# EAGLE design a314-q&d-vcf (EAGLE 7.5.1)
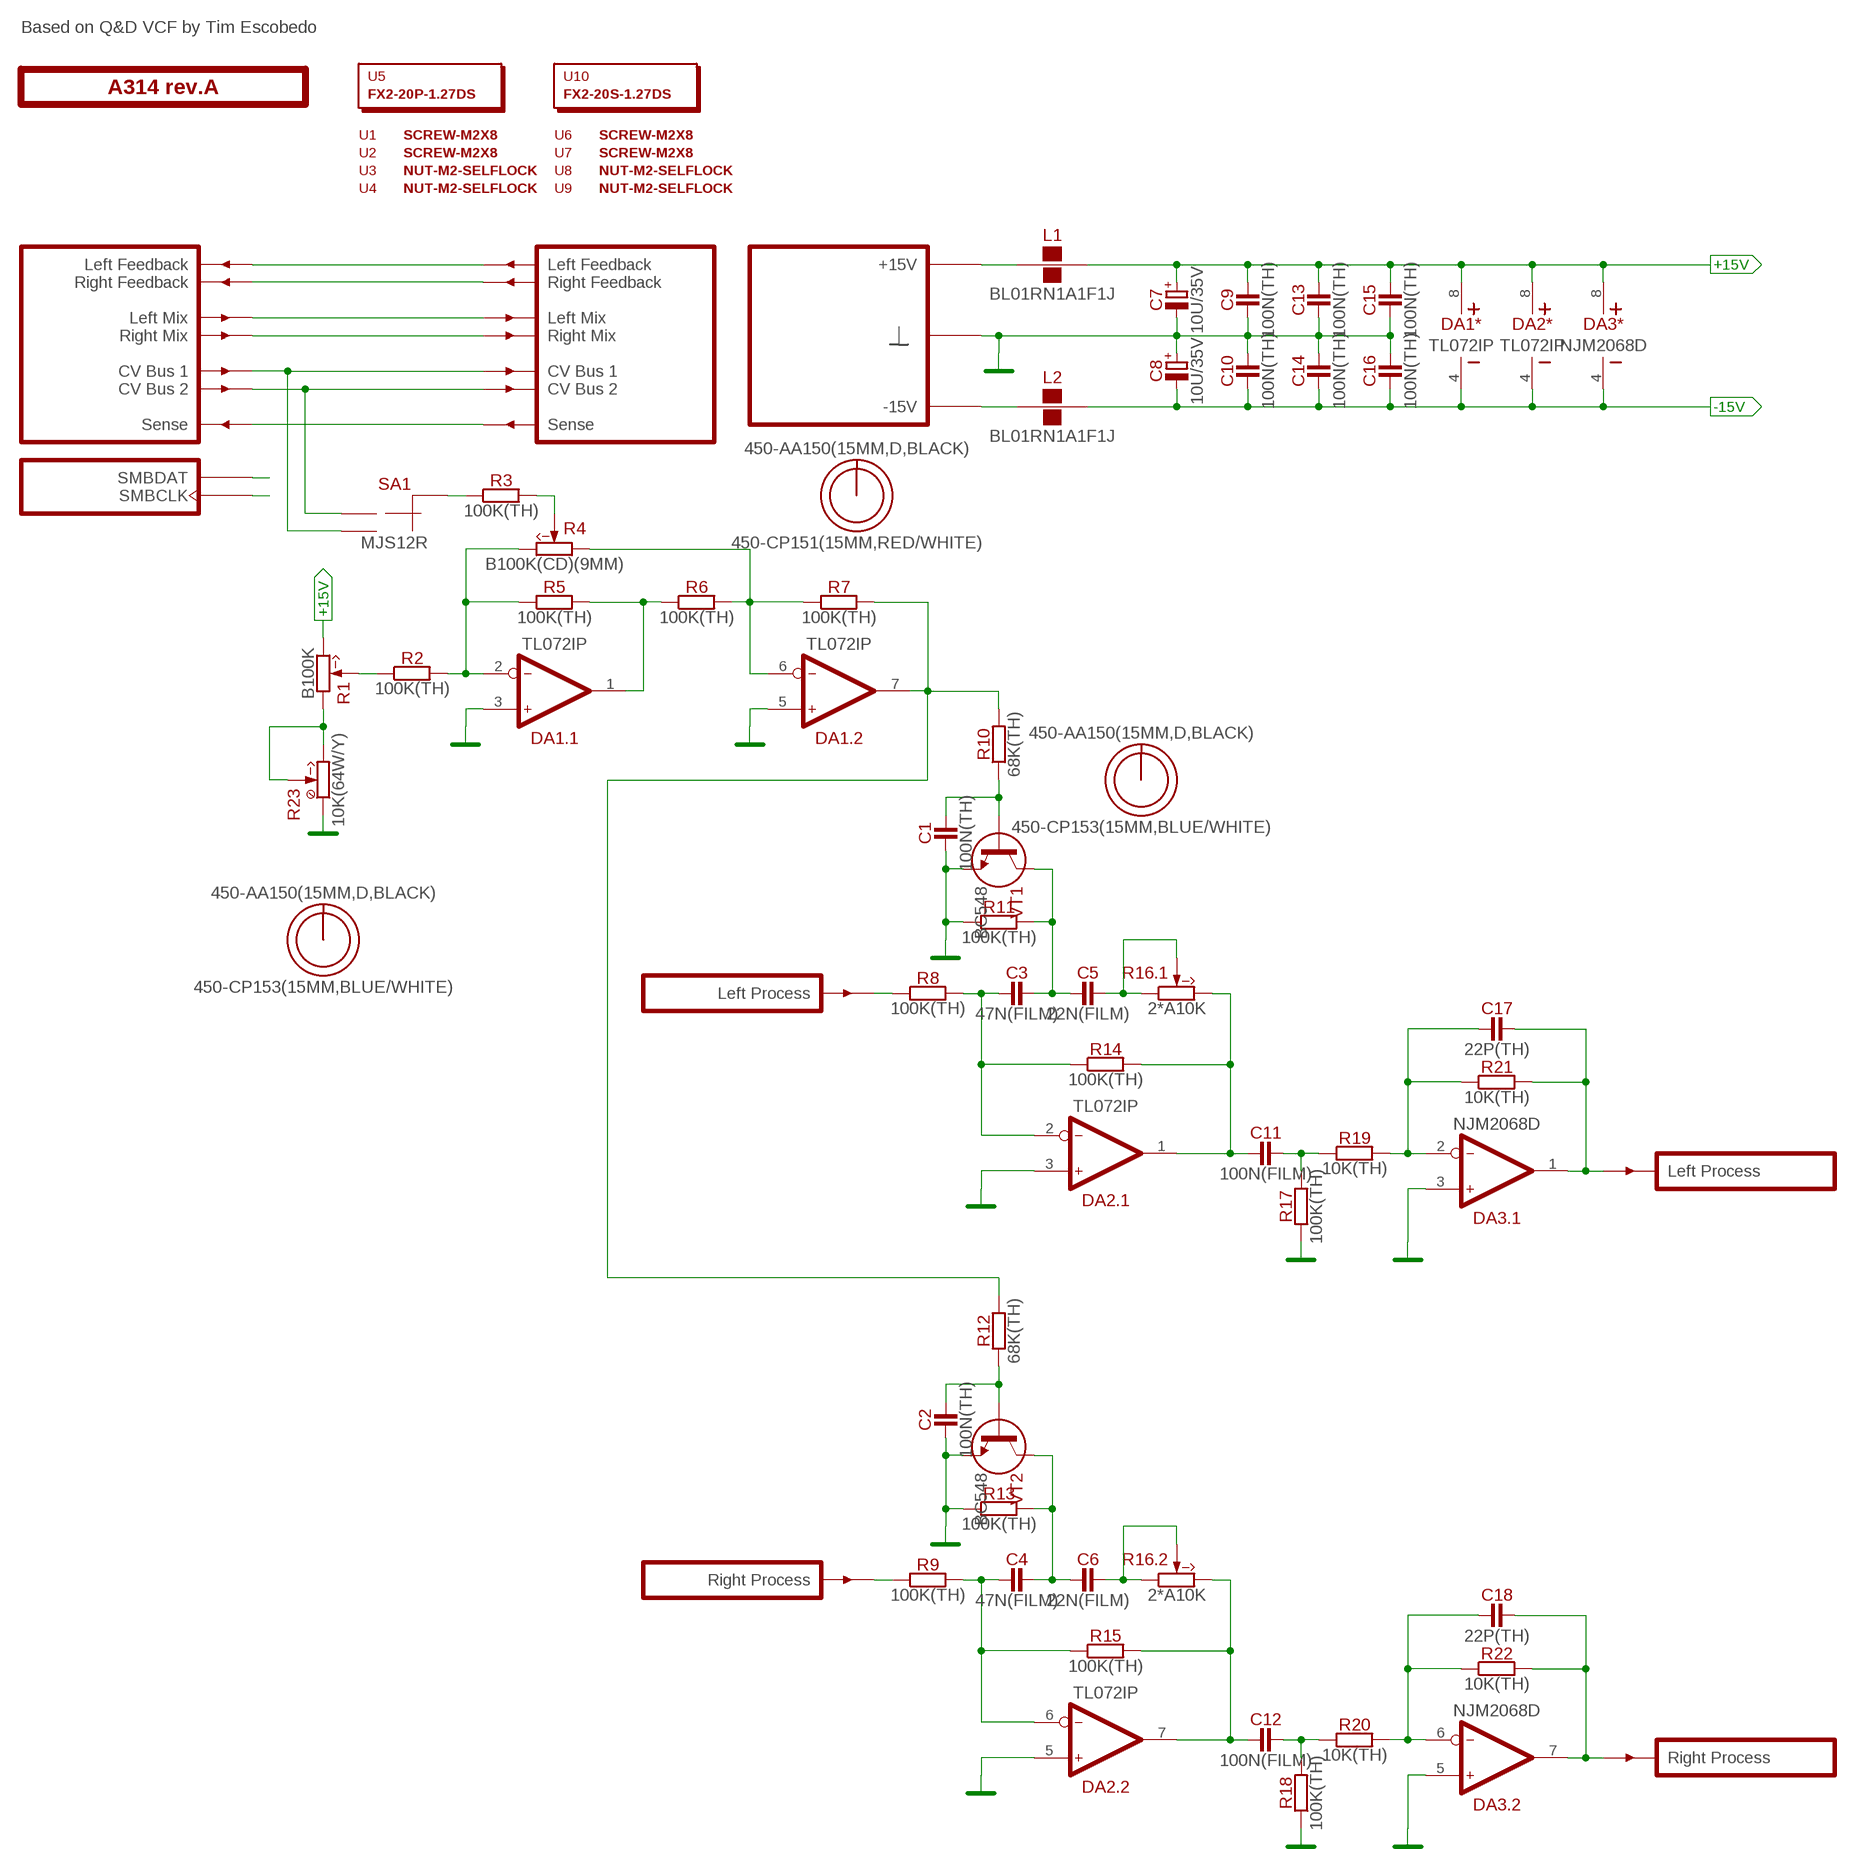
[diagram p0: schematic, sheet 1]

## Parts
C1  100N(TH)  [C050-024X044]
C2  100N(TH)  [C050-024X044]
C3  47N(FILM)  [C050-025X075]
C4  47N(FILM)  [C050-025X075]
C5  22N(FILM)  [C050-025X075]
C6  22N(FILM)  [C050-025X075]
C7  10U/35V  [E2-5]
C8  10U/35V  [E2-5]
C9  100N(TH)  [C050-024X044]
C10  100N(TH)  [C050-024X044]
C11  100N(FILM)  [C050-025X075]
C12  100N(FILM)  [C050-025X075]
C13  100N(TH)  [C050-024X044]
C14  100N(TH)  [C050-024X044]
C15  100N(TH)  [C050-024X044]
C16  100N(TH)  [C050-024X044]
C17  22P(TH)  [C050-024X044]
C18  22P(TH)  [C050-024X044]
DA1  TL072IP  [DIP-8]
DA2  TL072IP  [DIP-8]
DA3  NJM2068D  [DIP-8]
L1  BL01RN1A1F1J  [BL01RN1A]
L2  BL01RN1A1F1J  [BL01RN1A]
O1  450-AA150(15MM,D,BLACK)  [EMPTY]
O2  450-AA150(15MM,D,BLACK)  [EMPTY]
O3  450-AA150(15MM,D,BLACK)  [EMPTY]
O4  450-CP151(15MM,RED/WHITE)  [EMPTY]
O5  450-CP153(15MM,BLUE/WHITE)  [EMPTY]
O6  450-CP153(15MM,BLUE/WHITE)  [EMPTY]
PCB1  A314 rev.A  ST2-BOARD-50  [ST2-BOARD-50]
R1  B100K  [RV11-SINGLE]
R2  100K(TH)  [R-0207/10]
R3  100K(TH)  [R-0207/10]
R4  B100K(CD)(9MM)  [RV09-SINGLE]
R5  100K(TH)  [R-0207/10]
R6  100K(TH)  [R-0207/10]
R7  100K(TH)  [R-0207/10]
R8  100K(TH)  [R-0207/10]
R9  100K(TH)  [R-0207/10]
R10  68K(TH)  [R-0207/10]
R11  100K(TH)  [R-0207/10]
R12  68K(TH)  [R-0207/10]
R13  100K(TH)  [R-0207/10]
R14  100K(TH)  [R-0207/10]
R15  100K(TH)  [R-0207/10]
R16  2*A10K  2A10K  [RV11-DUAL]
R17  100K(TH)  [R-0207/10]
R18  100K(TH)  [R-0207/10]
R19  10K(TH)  [R-0207/10]
R20  10K(TH)  [R-0207/10]
R21  10K(TH)  [R-0207/10]
R22  10K(TH)  [R-0207/10]
R23  10K(64W/Y)  [64W]
SA1  MJS12R  [APEM-MJS12R]
U1  SCREW-M2X8  [EMPTY]
U2  SCREW-M2X8  [EMPTY]
U3  NUT-M2-SELFLOCK  [EMPTY]
U4  NUT-M2-SELFLOCK  [EMPTY]
U5  FX2-20P-1.27DS  [EMPTY]
U6  SCREW-M2X8  [EMPTY]
U7  SCREW-M2X8  [EMPTY]
U8  NUT-M2-SELFLOCK  [EMPTY]
U9  NUT-M2-SELFLOCK  [EMPTY]
U10  FX2-20S-1.27DS  [EMPTY]
VT1  BC548  [TO92]
VT2  BC548  [TO92]

## Nets
+15V: C7.+ C9.2 C13.2 C15.2 DA1.8(*:V+) DA2.8(*:V+) DA3.8(*:V+) L1.2 R1.3(CW)
-15V: C8.- C10.1 C14.1 C16.1 DA1.4(*:V-) DA2.4(*:V-) DA3.4(*:V-) L2.2
GND: C1.1 C2.1 C7.- C8.+ C9.1 C10.2 C13.1 C14.2 C15.1 C16.2 DA1.3(.1:IN+) DA1.5(.2:IN+) DA2.3(.1:IN+) DA2.5(.2:IN+) DA3.3(.1:IN+) DA3.5(.2:IN+) PCB1.B4'(GND) PCB1.B4(GND) PCB1.B5'(GND) PCB1.B5(GND) PCB1.B6'(GND) PCB1.B6(GND) PCB1.B7'(GND) PCB1.B7(GND) PCB1.B8'(GND) PCB1.B8(GND) R11.1 R13.1 R17.1 R18.1 R23.1(CCW) VT1.3(E) VT2.3(E)
LMIX: PCB1.ALMIX'(LMIX') PCB1.ALMIX(LMIX)
N$1: L1.1 PCB1.A+15'(P+15V) PCB1.A+15(P+15V) PCB1.B+15'(P+15V) PCB1.B+15(P+15V)
N$2: PCB1.ALFBK'(LFBK') PCB1.ALFBK(LFBK)
N$3: R3.2 R4.2(W)
N$4: PCB1.ARFBK'(RFBK') PCB1.ARFBK(RFBK)
N$5: DA1.2(.1:IN-) R2.2 R4.3(CW) R5.1
N$6: DA1.1(.1:OUT) R5.2 R6.1
N$7: DA1.6(.2:IN-) R4.1(CCW) R6.2 R7.1
N$8: C18.1 DA3.6(.2:IN-) R20.2 R22.1
N$9: R3.1 SA1.C(CM)
N$10: C4.1 DA2.6(.2:IN-) R9.2 R15.1
N$11: C3.1 DA2.2(.1:IN-) R8.2 R14.1
N$12: PCB1.BINL(INL) R8.1
N$13: R1.2(W) R2.1
N$14: C11.1 DA2.1(.1:OUT) R14.2 R16.3(.1:CW)
N$15: PCB1.ACV1'(CV1') PCB1.ACV1(CV1) SA1.NO
N$16: PCB1.BSENSE'(SENSE') PCB1.BSENSE(SENSE)
N$17: C11.2 R17.2 R19.1
N$18: C12.1 DA2.7(.2:OUT) R15.2 R16.3'(.2:CW)
N$19: C5.2 R16.1(.1:CCW) R16.2(.1:W)
N$20: C12.2 R18.2 R20.1
N$21: C6.2 R16.1'(.2:CCW) R16.2'(.2:W)
N$22: C3.2 C5.1 R11.2 VT1.1(C)
N$23: C1.2 R10.1 VT1.2(B)
N$24: C4.2 C6.1 R13.2 VT2.1(C)
N$25: L2.1 PCB1.A-15'(P-15V) PCB1.A-15(P-15V) PCB1.B-15'(P-15V) PCB1.B-15(P-15V)
N$26: C2.2 R12.1 VT2.2(B)
N$27: PCB1.BINR(INR) R9.1
N$28: DA1.7(.2:OUT) R7.2 R10.2 R12.2
N$29: C18.2 DA3.7(.2:OUT) PCB1.BOUTR'(OUTR) R22.2
N$30: C17.1 DA3.2(.1:IN-) R19.2 R21.1
N$31: C17.2 DA3.1(.1:OUT) PCB1.BOUTL'(OUTL) R21.2
N$33: R1.1(CCW) R23.3(CW) R23.S(W) R23.S@1(W)
N$38: PCB1.ASMBDAT'(SMBDAT) PCB1.ASMBDAT(SMBDAT)
N$42: PCB1.ACV2'(CV2') PCB1.ACV2(CV2) SA1.NC
N$43: PCB1.ASMBCLK'(SMBCLK) PCB1.ASMBCLK(SMBCLK)
RMIX: PCB1.ARMIX'(RMIX') PCB1.ARMIX(RMIX)

## Notes on the sheet
- Based on Q&D VCF by Tim Escobedo

## Library data of the parts
C1 C2 C9 C10 C13-C16 = capacitors:?; MOUSER: 81-RCER71H104K0A2H3B
C3 C4 = capacitors:?; MOUSER: 871-B32529C1473J
C5 C6 = capacitors:?; MOUSER: 80-R82EC2220DQ50J
C7 C8 = capacitors-electrolytic:?; MOUSER: 647-USW1V100MDD
C11 C12 = capacitors:?; MOUSER: 505-MKS2.1/63/5
C17 C18 = capacitors:?
DA1 DA2 = ic-ti:TL072; MOUSER: 595-TL072IP
DA3 = ic-jrc:NJM2068; MOUSER: 513-NJM2068D
L1 L2 = inductors:BL01RN1A?; MOUSER: 81-BL01RN1A1F1J
O1-O3 = hardware:450-AA?; MOUSER: 450-AA150
O4 = hardware:450-C?
O5 O6 = hardware:450-C?; MOUSER: 450-CP153
PCB1 = module-footprints:ST2-BOARD-?
R1 = potentiometers:?
R2 R3 R5-R9 R11 R13-R15 R17 R18 = resistors:?; MOUSER: 71-RN55D-F-100K
R4 = potentiometers:?; MOUSER: 652-PTV09A-4225FB104
R10 R12 = resistors:?
R16 = potentiometers:2**?; MOUSER: 688-RK12L12C0A0E
R19-R22 = resistors:?; MOUSER: 71-RN55D-F-10K
R23 = potentiometers:?(64W/Y); MOUSER: 858-64WR10KLF
SA1 = switches:MJS12R; MOUSER: 642-MJS12R
U1-U4 U6-U9 = hardware:*?
U5 = hardware:?; MOUSER: 798-FX2-20P-1.27DS71
U10 = hardware:?; MOUSER: 798-FX2-20S-1.27DS71
VT1 VT2 = transistors-npn:?

## Board
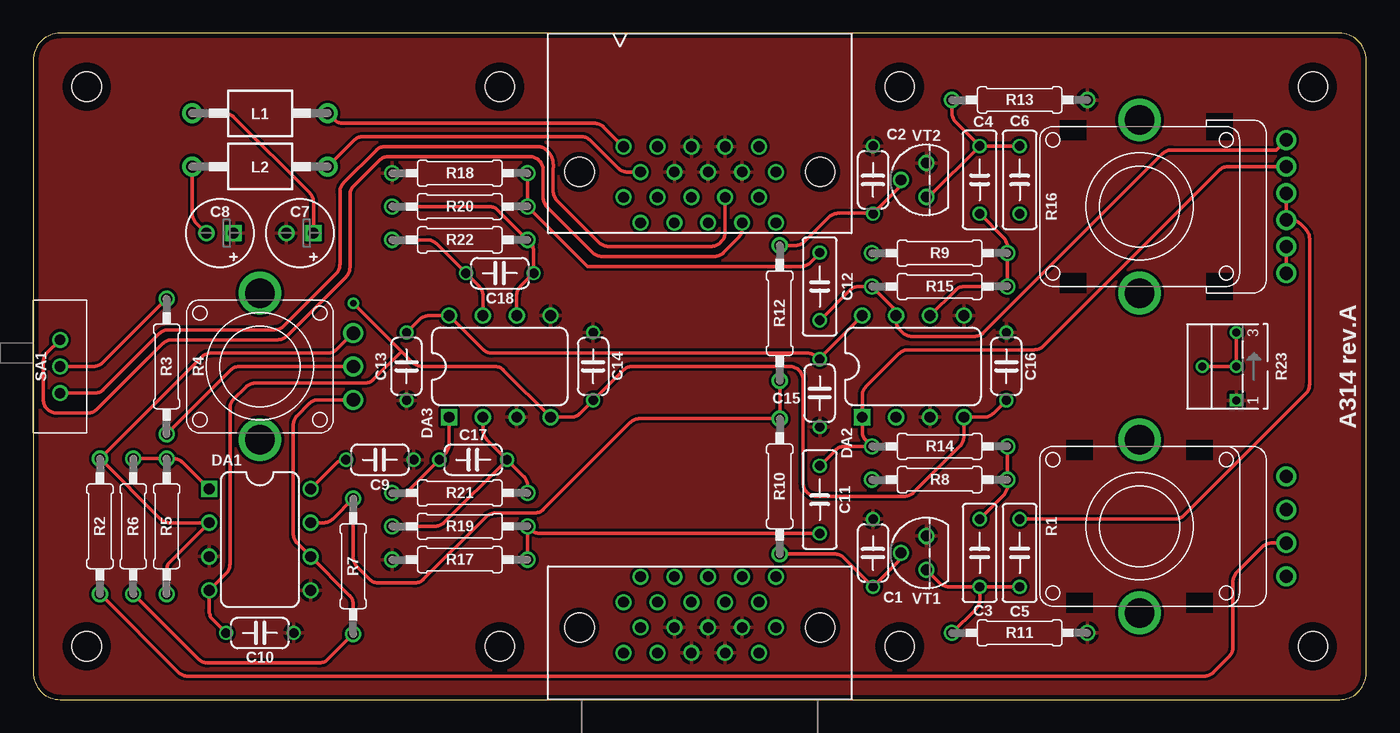
[diagram p1: board, top side]
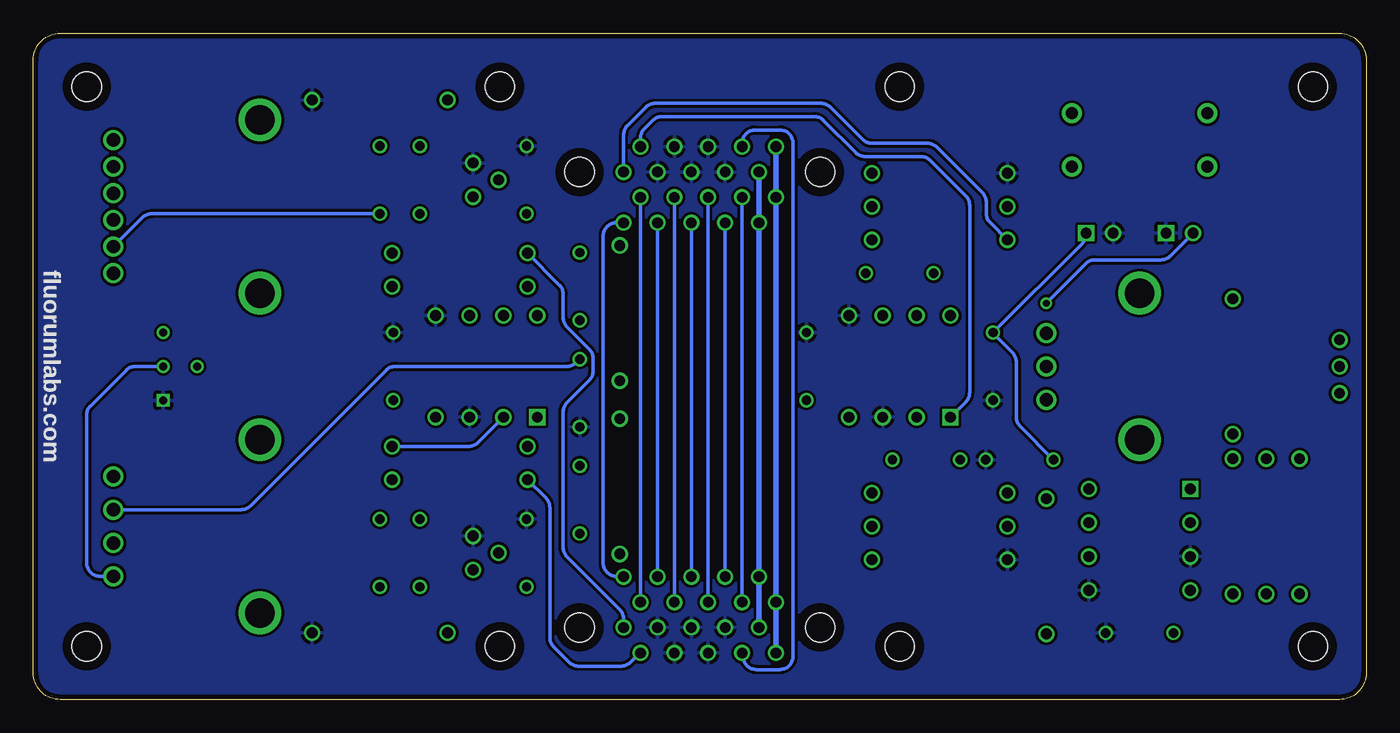
[diagram p2: board, bottom side, seen from below]

Size 100 x 50 mm. Coordinates in mm from the lower left corner, seen from the top.
Outline: 0,48 0,2 arc90 2,0 98,0 arc90 100,2 100,48 arc90 98,50 2,50 arc90 0,48
Copper layers (1*16): Top 0.0356mm / dielectric 1.5011mm / Bottom 0.0356mm
Design rules "sonictrain": minimum track width 6mil, minimum drill 13mil, track to track 8mil, track to pad 8mil, pad to pad 6mil, via to via 6mil, smd to smd 6mil, copper to edge 15mil, drill to drill 6mil, minimum pad ring 7mil, minimum via ring 7mil, stop-mask expansion 3mil, vias tented up to drill 25mil, thermal gap 10mil

### Footprints (pad centres in the part's own frame; a part is rotated, then mirrored left to right if it is on the bottom)
C050-024X044 = drill 0.7: 1 -2.54,0; 2 2.54,0
C050-025X075 = drill 0.7: 1 -2.54,0; 2 2.54,0
E2-5 = drill 0.813 square: + -1.016,0 | drill 0.813: - 1.016,0
DIP-8 = drill 0.813 square: 1 -3.81,-3.81 | drill 0.813: 2 -1.27,-3.81; 3 1.27,-3.81; 4 3.81,-3.81; 5 3.81,3.81; 6 1.27,3.81; 7 -1.27,3.81; 8 -3.81,3.81
BL01RN1A = drill 0.9 pad 1.5: 1 -5.08,0; 2 5.08,0
ST2-BOARD-50 = drill 0.8: A+15 44.285,7.31; A+15' 44.285,37.69; A-15 45.555,9.215; A-15' 45.555,35.785; ACV1 51.905,7.31; ACV1' 51.905,37.69; ACV2 53.175,9.215; ACV2' 53.175,35.785; ALFBK 49.365,7.31; ALFBK' 49.365,37.69; ALMIX 46.825,7.31; ALMIX' 46.825,37.69; ARFBK 50.635,9.215; ARFBK' 50.635,35.785; ARMIX 48.095,9.215; ARMIX' 48.095,35.785; ASMBCLK 55.715,9.215; ASMBCLK' 55.715,35.785; ASMBDAT 54.445,7.31; ASMBDAT' 54.445,37.69; B4 48.095,5.405; B4' 48.095,39.595; B5 49.365,3.5; B5' 49.365,41.5; B6 50.635,5.405; B6' 50.635,39.595; B7 51.905,3.5; B7' 51.905,41.5; B8 53.175,5.405; B8' 53.175,39.595; B+15 44.285,3.5; B+15' 44.285,41.5; B-15 45.555,5.405; B-15' 45.555,39.595; BINL 54.445,3.5; BINR 55.715,5.405; BOUTL' 54.445,41.5; BOUTR' 55.715,39.595; BSENSE 46.825,3.5; BSENSE' 46.825,41.5 | hole 2.2: 4,4; 4,46; 96,4; 96,46; 35,46; 65,46; 65,4; 35,4; 59.025,5.405; 40.975,5.405; 40.975,39.595; 59.025,39.595
RV11-SINGLE = drill 1: 1 -3.75,-11; 2 -1.25,-11; 3 1.25,-11; 4 3.75,-11 | drill 2.2: S1 -6.5,0; S2 6.5,0
R-0207/10 = drill 0.813: 1 -5.08,0; 2 5.08,0
RV09-SINGLE = drill 1: 1 -2.5,-7; 2 0,-7; 3 2.5,-7 | drill 2.2: S1 -5.5,0; S2 5.5,0
RV11-DUAL = drill 1: 1 -1,-11; 1' -3,-11; 2 1,-11; 2' -5,-11; 3 3,-11; 3' 5,-11 | drill 2.2: S1 -6.5,0; S2 6.5,0
64W = drill 0.6 square: 1 2.54,0 | drill 0.6: 3 -2.54,0; S 0,-2.54; S@1 0,0
APEM-MJS12R = drill 0.8: C 0,-2; NC 2,-2; NO -2,-2
TO92 = drill 0.813: 1 -1.27,0; 2 0,1.905; 3 1.27,0

### Placement (x,y rotation side)
C1  63,11 270 top
C2  63,39 270 top
C3  71,11 270 top
C4  71,39 90 top
C5  74,11 90 top
C6  74,39 270 top
C7  20,35 180 top
C8  14,35 180 top
C9  26,18 180 top
C10  17,5 0 top
C11  59,15 270 top
C12  59,31 90 top
C13  28,25 90 top
C14  42,25 90 top
C15  59,23 90 top
C16  73,25 90 top
C17  33,18 180 top
C18  35,32 180 top
DA1  17,12 270 top
DA2  66,25 0 top
DA3  35,25 0 top
L1  17,44 180 top
L2  17,40 180 top
O1  -8,-101.25 0 top  (outside the outline)
O2  -9,-102.5 0 top  (outside the outline)
O3  -10,-103.75 0 top  (outside the outline)
O4  -11,-105 0 top  (outside the outline)
O5  -12,-106.25 0 top  (outside the outline)
O6  -13,-107.5 0 top  (outside the outline)
PCB1  0,0 0 top
R1  83,13 90 top
R2  5,13 90 top
R3  10,25 270 top
R4  17,25 90 top
R5  10,13 90 top
R6  7.5,13 270 top
R7  24,10 90 top
R8  68,16.5 0 top
R9  68,33.5 0 top
R10  56,16 90 top
R11  74,5 180 top
R12  56,29 270 top
R13  74,45 180 top
R14  68,19 180 top
R15  68,31 180 top
R16  83,37 90 top
R17  32,10.5 0 top
R18  32,39.5 0 top
R19  32,13 180 top
R20  32,37 180 top
R21  32,15.5 180 top
R22  32,34.5 180 top
R23  90.25,25 270 top
SA1  0,25 90 top
U1  54,-100 0 top  (outside the outline)
U2  57,-100 0 top  (outside the outline)
U3  60,-100 0 top  (outside the outline)
U4  63,-100 0 top  (outside the outline)
U5  66,-100 0 top  (outside the outline)
U6  69,-100 0 top  (outside the outline)
U7  72,-100 0 top  (outside the outline)
U8  75,-100 0 top  (outside the outline)
U9  78,-100 0 top  (outside the outline)
U10  81,-100 0 top  (outside the outline)
VT1  67,11 90 top
VT2  67,39 90 top

### Tracks (layer width: path | path; a pad name or v marks a point on that pad's centre or on a via)
+15V
  Top 0.254: C9.2 23.41,18 arc45 22.71,17.71 DA1.8 | C13.2 28.98,28.52 arc-45 29.68,28.81 DA3.8 33.71,26.29 arc45 34.41,26 58.09,26 arc-45 58.79,25.71 58.96,25.54 C15.2 59,25.62 DA2.8 | C7.+ 21.02,37.32 arc45 20.72,38.03 15.04,43.71 arc45 14.34,44 L1.2
  Bottom 0.254: R1.3 84.41,14.25 arc-45 83.71,14.54 73.54,24.71 arc45 72.84,25 59.95,25 arc-45 59.25,25.29 C15.2 | C7.+ 21.02,34.94 arc45 21.31,34.23 C13.2 28,27.5 26.54,26.04 arc45 26.25,25.34 26.25,21.2 arc-45 25.96,20.5 C9.2
-15V  (via drill 0.5)
  Top 0.254: C10.1 13.48,5.98 arc-45 13.19,6.68 DA1.4 14.46,9.46 arc45 14.75,10.16 14.75,21.84 arc-45 15.04,22.54 15.96,23.46 arc-45 16.66,23.75 24.84,23.75 arc45 25.54,24.04 27.62,26.12 | C16.1 72.02,21.48 arc-45 71.32,21.19 DA2.4 69.81,19.72 arc-45 69.52,19.02 66.04,15.54 arc-45 65.34,15.25 58.75,15.25 arc-90 57.75,16.25 57.75,24 arc90 56.75,25 44.95,25 arc45 44.25,24.71 C14.1 41.02,21.48 arc-45 40.32,21.19 DA3.4 35.29,24.71 arc45 34.59,25 29.16,25 arc-45 28.46,25.29 27.62,26.12 | L2.2 11.92,36.48 arc45 12.21,35.77 C8.- | 27.62,26.12 v24,29.75
  Bottom 0.254: v24,29.75 21.04,32.71 arc45 20.34,33 15.4,33 arc-45 14.69,33.29 C8.-
GND
  pour Bottom: 0,50 100,50 100,0 0,0
  pour Top: 0,50 100,50 100,0 0,0
LMIX
  Bottom 0.254: PCB1.ALMIX PCB1.ALMIX'
N$1
  Top 0.254: PCB1.B+15' 44.25,41.5 42.79,42.96 arc45 42.09,43.25 23.24,43.25 arc-45 22.54,43.54 L1.1
  Bottom 0.406: PCB1.B+15 PCB1.A+15 PCB1.A+15' PCB1.B+15'
N$2
  Bottom 0.254: PCB1.ALFBK PCB1.ALFBK'
N$3
  Top 0.254: R4.2 15.49,25 arc45 14.79,24.71 R3.2
N$4
  Bottom 0.254: PCB1.ARFBK' PCB1.ARFBK
N$5
  Top 0.254: R4.3 22.79,26.29 arc-45 22.09,26 13.33,26 arc45 12.63,25.71 R2.2 9.52,13.56 arc45 10.22,13.27 DA1.2 10.29,10.37 arc45 10,9.67 R5.1
N$6
  Top 0.254: R6.1 R5.2 10.51,18.08 arc-45 11.21,17.79 DA1.1
N$7
  Top 0.254: R4.1 21.41,22.5 arc45 20.71,22.21 19.79,21.29 arc45 19.5,20.59 19.5,12.45 arc45 19.79,11.75 DA1.6 23.71,7.83 arc-45 24,7.13 R7.1 22.12,3.04 arc-45 21.42,2.75 13.08,2.75 arc-45 12.38,3.04 R6.2
N$8
  Top 0.254: DA3.6 36.27,30.32 arc-45 36.56,31.02 C18.1 37.54,33.63 arc45 37.25,34.33 R22.1 34.87,36.71 arc45 34.17,37 R20.2
N$9
  Top 0.254: SA1.C 4.51,25 arc45 5.21,25.29 R3.1
N$10
  Top 0.254: DA2.6 69.17,30.71 arc-45 69.87,31 R15.1 R9.2 73.08,33.97 arc45 72.79,34.67 C4.1
N$11
  Top 0.254: R14.1 R8.2 73.08,16.03 arc-45 72.79,15.33 C3.1
  Bottom 0.254: R14.1 67.33,19 arc-45 66.63,19.29 DA2.2
N$12
  Bottom 0.254: PCB1.BINL 54.5,3.5 55.21,2.79 arc45 55.91,2.5 59.09,2.5 arc45 59.79,2.79 60.96,3.96 arc45 61.25,4.66 61.25,14.42 arc-45 61.54,15.12 R8.1
N$13
  Top 0.254: R1.2 92.91,11.75 arc45 92.21,11.46 90.29,9.54 arc45 90,8.84 90,3.91 arc-45 89.71,3.21 88.54,2.04 arc-45 87.84,1.75 11.58,1.75 arc-45 10.88,2.04 R2.1
N$14
  Top 0.254: C11.1 60.17,18.71 arc-45 60.87,19 R14.2 62.48,19.44 arc-45 62.19,20.14 DA2.1 62.19,22.78 arc-45 62.48,23.48 64.96,25.96 arc-45 65.66,26.25 75.09,26.25 arc45 75.79,26.54 88.96,39.71 arc-45 89.66,40 R16.3
N$15
  Top 0.254: PCB1.ACV1' 51.91,35.07 arc-45 51.61,34.36 51.54,34.29 arc-45 50.84,34 43.16,34 arc-45 42.46,34.29 39.29,37.46 arc-45 39,38.16 39,39.84 arc45 38.71,41.04 38.54,41.21 arc45 37.84,41.5 26.41,41.5 arc45 25.71,41.21 23.29,38.79 arc45 23,38.09 23,32.66 arc-45 22.71,31.96 18.79,28.04 arc-45 18.09,27.75 10.16,27.75 arc45 9.46,27.46 5.29,23.29 arc-45 4.59,23 SA1.NO
  Bottom 0.254: PCB1.ACV1 PCB1.ACV1'
N$16
  Bottom 0.254: PCB1.BSENSE' 46.83,41.75 arc90 45.83,42.75 44,42.75 arc90 43,41.75 43,3.25 arc90 44,2.25 45.75,2.25 arc90 46.75,3.25 46.75,3.42 PCB1.BSENSE
N$17
  Top 0.254: R17.2 R19.1 37.33,12.75 arc45 38.03,12.46 C11.2
N$18
  Top 0.254: C12.1 61.25,30.71 arc-45 61.95,31 R15.2 64.46,29.46 arc-45 DA2.7 64.73,28.43 arc45 65.02,27.73 65.21,27.54 arc45 65.91,27.25 70.59,27.25 arc45 71.29,27.54 84.71,40.96 arc-45 85.41,41.25 93.25,41.25 R16.3'
N$19
  Top 0.254: R16.2 R16.1 94.34,36 arc-45 95.04,35.71 95.46,35.29 arc-45 95.75,34.59 95.75,23.66 arc-45 95.46,22.96 86.33,13.83 arc-45 85.63,13.54 C5.2
N$20
  Top 0.254: R18.2 R20.1 41.58,32.5 57.59,32.5 arc45 58.29,32.79 59,33.5 C12.2
N$21
  Top 0.254: R16.2' R16.1'
  Bottom 0.254: C6.2 91.13,36.46 arc-45 91.83,36.17 R16.1'
N$22
  Top 0.254: C5.1 C3.2 | C3.2 71,7.49 arc-45 70.71,6.79 R11.2 | C3.2 68.68,8.46 arc-45 67.98,8.75 VT1.1
N$23
  Top 0.254: VT1.2 65.09,10.97 arc-45 64.8,10.26 C1.2 60.83,10.63 arc45 60.13,10.92 R10.1
N$24
  Top 0.254: C6.1 C4.2 | R13.2 68.92,44.03 arc45 69.21,43.33 C4.2 | VT2.1 67.19,37.73 C4.2
N$25
  Top 0.254: PCB1.B-15' 44.57,39.59 arc-45 43.86,39.89 41.79,41.96 arc45 41.09,42.25 24.74,42.25 arc45 24.04,41.96 L2.1
  Bottom 0.406: PCB1.B-15' PCB1.A-15' PCB1.A-15 PCB1.B-15
N$26
  Top 0.254: VT2.2 65.09,38.97 arc-45 64.8,38.26 C2.2 62.96,36.5 60.41,36.5 arc45 59.71,36.21 57.87,34.37 arc-45 57.17,34.08 R12.1
N$27
  Bottom 0.254: PCB1.BINR 55.72,6.05 arc-45 56.01,6.76 59.96,10.71 arc45 60.25,11.41 60.25,21.59 arc45 59.96,22.29 58.29,23.96 arc-45 58,24.66 58,25.59 arc-45 58.29,26.29 59.96,27.96 arc45 60.25,28.66 60.25,30.42 arc-45 60.54,31.12 R9.1
N$28
  Top 0.254: DA1.7 21.78,13.27 arc45 22.48,13.56 R7.2 24,10.66 arc45 24.29,9.96 25.21,9.04 arc45 25.91,8.75 28.59,8.75 arc45 29.29,9.04 33.96,13.71 arc-45 34.66,14 37.59,14 arc45 38.29,14.29 44.79,20.79 arc-45 45.49,21.08 R10.2 R12.2
N$29
  Top 0.254: DA3.7 33.73,30.32 arc45 33.44,31.02 C18.2 30.25,34.21 arc45 29.55,34.5 R22.2
  Bottom 0.254: PCB1.BOUTR' 55.72,42.37 arc45 55.42,43.08 54.04,44.46 arc45 53.34,44.75 40.91,44.75 arc45 40.21,44.46 37.79,42.04 arc-45 37.09,41.75 32.91,41.75 arc45 32.21,41.46 28.79,38.04 arc45 28.5,37.34 28.5,36.49 arc-45 28.21,35.79 R22.2
N$30
  Top 0.254: DA3.2 33.73,20.22 arc45 34.02,19.52 C17.1 | R21.1 37.08,16.05 arc45 36.79,16.75 C17.1 | R19.2 30.13,13 arc45 30.83,13.29 C17.1
N$31
  Top 0.254: DA3.1 31.19,19.14 arc-45 30.9,18.44 C17.2 28.25,15.79 arc-45 27.55,15.5 R21.2
  Bottom 0.254: PCB1.BOUTL' 54.45,42.14 arc45 54.15,42.85 53.54,43.46 arc45 52.84,43.75 41.41,43.75 arc45 40.71,43.46 38.29,41.04 arc-45 37.59,40.75 33.41,40.75 arc45 32.71,40.46 30.04,37.79 arc45 29.75,37.09 29.75,23.04 arc45 30.04,22.34 DA3.1
N$33
  Top 0.254: R23.S R23.S@1 R23.3
  Bottom 0.254: R23.S@1 92.34,25 arc-45 93.04,24.71 95.71,22.04 arc-45 96,21.34 96,10.25 arc-90 95,9.25 R1.1
N$38
  Bottom 0.254: PCB1.ASMBDAT PCB1.ASMBDAT'
N$42
  Top 0.254: PCB1.ACV2' 53.17,35.34 arc-45 52.88,34.63 51.79,33.54 arc-45 51.09,33.25 42.66,33.25 arc-45 41.96,33.54 38.54,36.96 arc-45 38.25,37.66 38.25,39.75 arc90 37.25,40.75 26.66,40.75 arc45 25.96,40.46 24.04,38.54 arc45 23.75,37.84 23.75,32.41 arc-45 23.46,31.71 19.04,27.29 arc-45 18.34,27 10.41,27 arc45 9.71,26.71 4.79,21.79 arc-45 4.09,21.5 1.75,21.5 arc-90 0.75,22.5 0.75,25.34 arc-45 1.04,26.04 SA1.NC
  Bottom 0.254: PCB1.ACV2' PCB1.ACV2
N$43
  Bottom 0.254: PCB1.ASMBCLK' 56.25,35.78 arc-90 57.25,34.78 57.25,10.25 arc-90 56.25,9.25 55.75,9.25 PCB1.ASMBCLK
RMIX
  Bottom 0.254: PCB1.ARMIX' PCB1.ARMIX